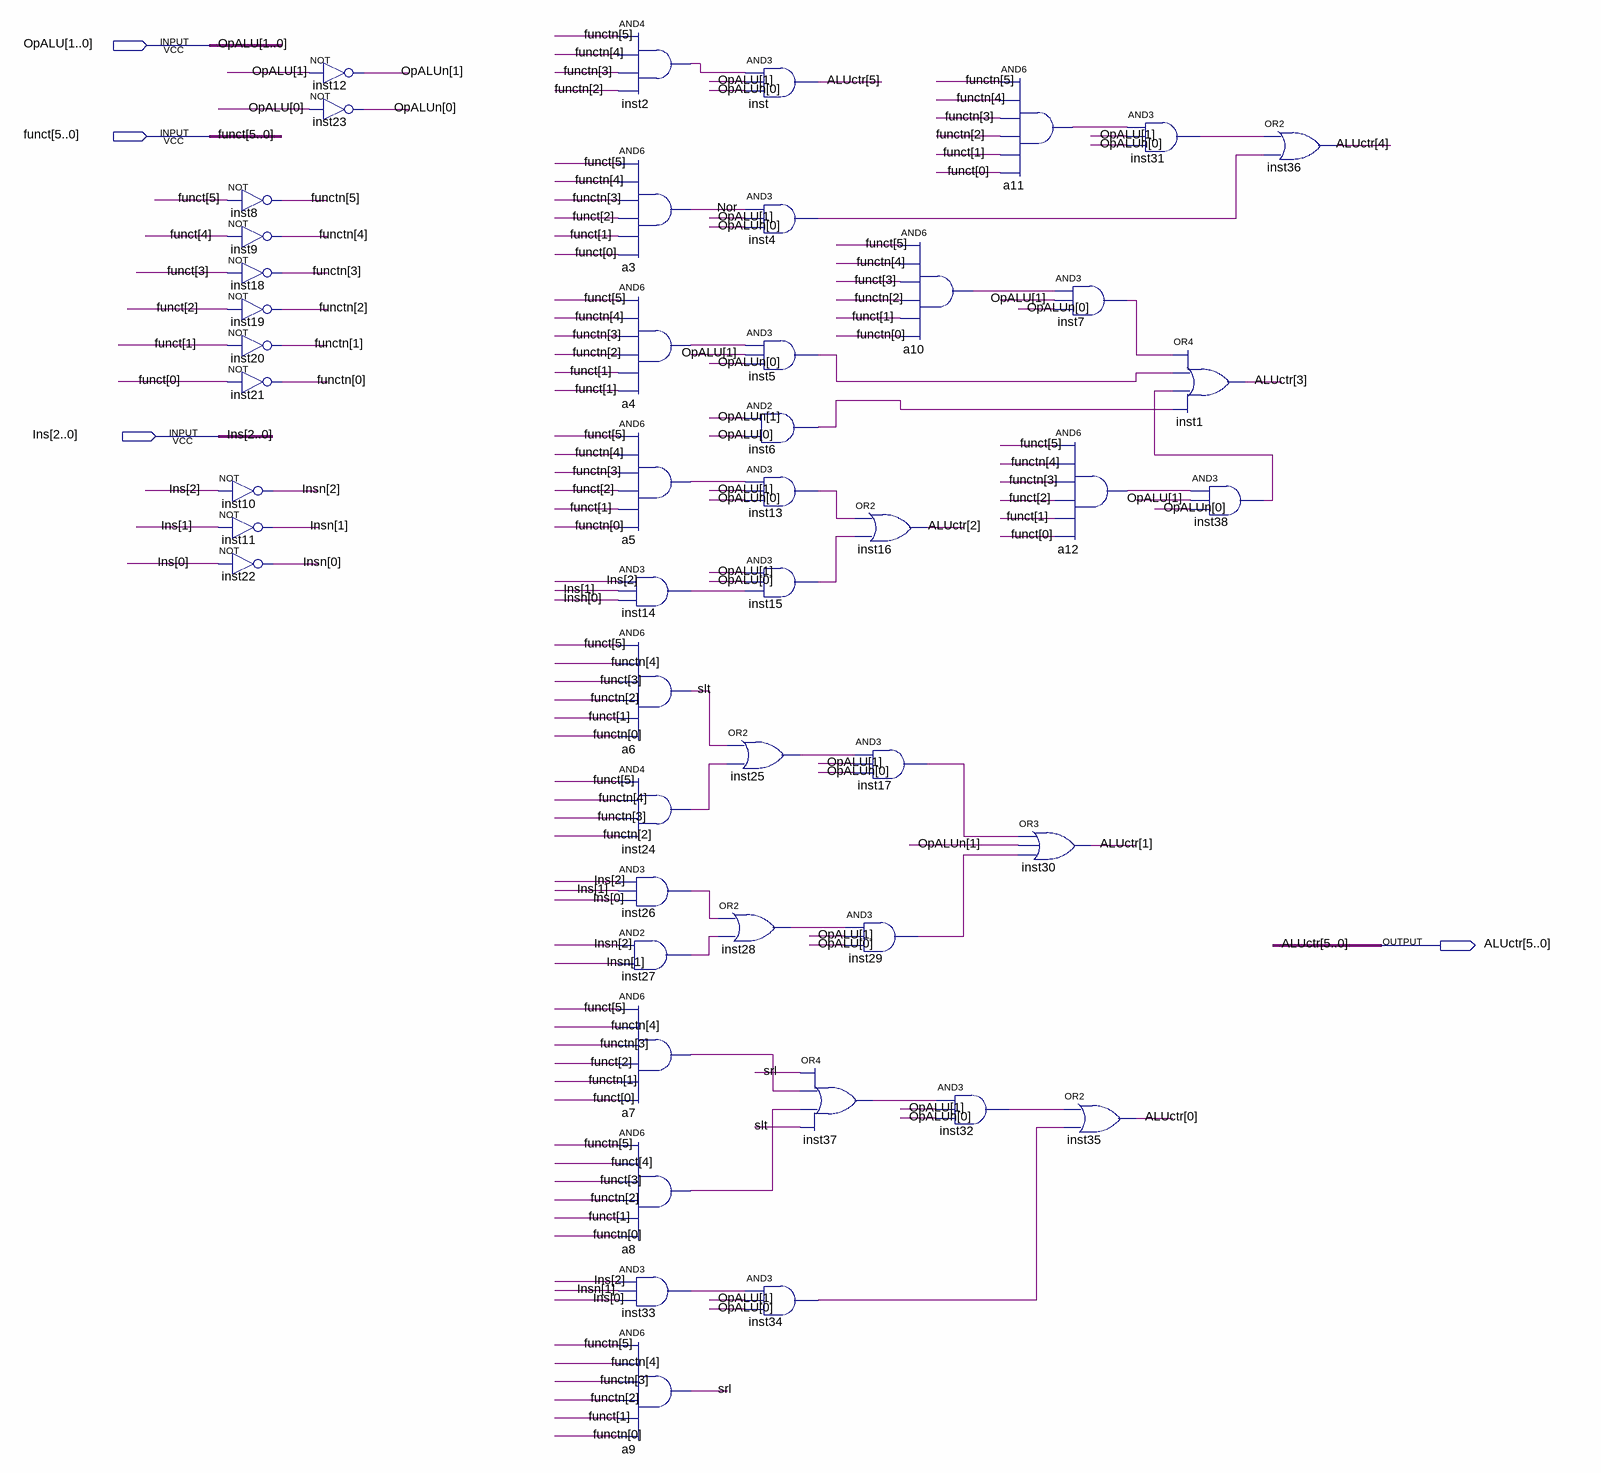
[diagram p0: schematic sheet]
// Quartus schematic CtrlALU.bdf as structural Verilog: 48 symbols, 4 pins
module CtrlALU (
  input  [1:0] OpALU,
  input  [5:0] funct,
  input  [2:0] Ins,
  output [5:0] ALUctr
);

  wire a4_out, a5_out, a7_out, a8_out, a10_out, a11_out, a12_out, inst2_out, inst4_out, inst5_out, inst6_out,
       inst7_out, inst13_out, inst14_out, inst15_out, inst17_out, inst24_out, inst25_out, inst26_out,
       inst27_out, inst28_out, inst29_out, inst31_out, inst32_out, inst33_out, inst34_out, inst37_out,
       inst38_out, Nor, slt, srl;
  wire [1:0] OpALUn;
  wire [2:0] Insn;
  wire [5:0] functn;

  not inst8 (functn[5], funct[5]);
  not inst9 (functn[4], funct[4]);
  not inst18 (functn[3], funct[3]);
  not inst19 (functn[2], funct[2]);
  not inst20 (functn[1], funct[1]);
  not inst21 (functn[0], funct[0]);
  not inst10 (Insn[2], Ins[2]);
  not inst11 (Insn[1], Ins[1]);
  not inst22 (Insn[0], Ins[0]);
  not inst12 (OpALUn[1], OpALU[1]);
  not inst23 (OpALUn[0], OpALU[0]);
  and inst2 (inst2_out, functn[5], functn[4], functn[3], functn[2]);
  and a3 (Nor, funct[5], functn[4], functn[3], funct[2], funct[1], funct[0]);
  and a4 (a4_out, funct[5], functn[4], functn[3], functn[2], funct[1], funct[1]);
  and a5 (a5_out, funct[5], functn[4], functn[3], funct[2], funct[1], functn[0]);
  and inst14 (inst14_out, Ins[2], Ins[1], Insn[0]);
  and a6 (slt, funct[5], functn[4], funct[3], functn[2], funct[1], functn[0]);
  and inst24 (inst24_out, funct[5], functn[4], functn[3], functn[2]);
  and inst26 (inst26_out, Ins[2], Ins[1], Ins[0]);
  and inst27 (inst27_out, Insn[2], Insn[1]);
  and a7 (a7_out, funct[5], functn[4], functn[3], funct[2], functn[1], funct[0]);
  and a8 (a8_out, functn[5], funct[4], funct[3], functn[2], funct[1], functn[0]);
  and inst33 (inst33_out, Ins[2], Insn[1], Ins[0]);
  and a9 (srl, functn[5], functn[4], functn[3], functn[2], funct[1], functn[0]);
  and inst (ALUctr[5], inst2_out, OpALU[1], OpALUn[0]);
  and inst4 (inst4_out, Nor, OpALU[1], OpALUn[0]);
  and inst5 (inst5_out, a4_out, OpALU[1], OpALUn[0]);
  and inst6 (inst6_out, OpALUn[1], OpALU[0]);
  and inst13 (inst13_out, a5_out, OpALU[1], OpALUn[0]);
  and inst15 (inst15_out, OpALU[1], OpALU[0], inst14_out);
  or inst25 (inst25_out, slt, inst24_out);
  or inst28 (inst28_out, inst26_out, inst27_out);
  and inst34 (inst34_out, inst33_out, OpALU[1], OpALU[0]);
  or inst16 (ALUctr[2], inst13_out, inst15_out);
  and inst17 (inst17_out, inst25_out, OpALU[1], OpALUn[0]);
  and inst29 (inst29_out, inst28_out, OpALU[1], OpALU[0]);
  or inst37 (inst37_out, srl, a7_out, a8_out, slt);
  and a10 (a10_out, funct[5], functn[4], funct[3], functn[2], funct[1], functn[0]);
  and a11 (a11_out, functn[5], functn[4], functn[3], functn[2], funct[1], funct[0]);
  and inst32 (inst32_out, inst37_out, OpALU[1], OpALUn[0]);
  and inst7 (inst7_out, a10_out, OpALU[1], OpALUn[0]);
  and a12 (a12_out, funct[5], functn[4], functn[3], funct[2], funct[1], funct[0]);
  or inst30 (ALUctr[1], inst17_out, OpALUn[1], inst29_out);
  or inst35 (ALUctr[0], inst32_out, inst34_out);
  and inst31 (inst31_out, a11_out, OpALU[1], OpALUn[0]);
  or inst1 (ALUctr[3], inst7_out, inst5_out, inst38_out, inst6_out);
  and inst38 (inst38_out, a12_out, OpALU[1], OpALUn[0]);
  or inst36 (ALUctr[4], inst31_out, inst4_out);
endmodule
